# EAGLE design Neuralynx_EIB16 (EAGLE 6.3)
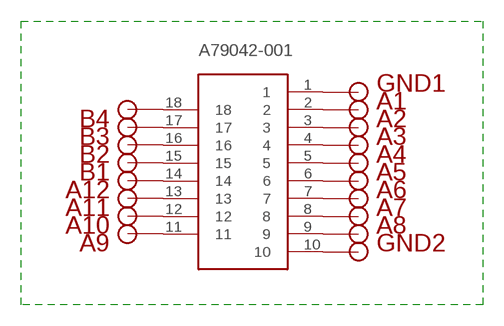
[diagram p0: schematic, sheet 1]

## Parts
A1  VIA_20MILL  [VIA_20MIL]
A2  VIA_20MILL  [VIA_20MIL]
A3  VIA_20MILL  [VIA_20MIL]
A4  VIA_20MILL  [VIA_20MIL]
A5  VIA_20MILL  [VIA_20MIL]
A6  VIA_20MILL  [VIA_20MIL]
A7  VIA_20MILL  [VIA_20MIL]
A8  VIA_20MILL  [VIA_20MIL]
A9  VIA_20MILL  [VIA_20MIL]
A10  VIA_20MILL  [VIA_20MIL]
A11  VIA_20MILL  [VIA_20MIL]
A12  VIA_20MILL  [VIA_20MIL]
A79042-001  A79043-001  [OMNETCS-18PIN-SMD]
B1  VIA_20MILL  [VIA_20MIL]
B2  VIA_20MILL  [VIA_20MIL]
B3  VIA_20MILL  [VIA_20MIL]
B4  VIA_20MILL  [VIA_20MIL]
GND1  VIA_20MILL  [VIA_20MIL]
GND2  VIA_20MILL  [VIA_20MIL]

## Nets
N$1: A79042-001.1 GND1.P$1
N$2: A79042-001.10 GND2.P$1
N$3: A8.P$1 A79042-001.9
N$4: A7.P$1 A79042-001.8
N$5: A6.P$1 A79042-001.7
N$6: A5.P$1 A79042-001.6
N$7: A4.P$1 A79042-001.5
N$8: A3.P$1 A79042-001.4
N$9: A2.P$1 A79042-001.3
N$10: A1.P$1 A79042-001.2
N$11: A9.P$1 A79042-001.11
N$12: A10.P$1 A79042-001.12
N$13: A12.P$1 A79042-001.14
N$14: A79042-001.15 B1.P$1
N$15: A79042-001.16 B2.P$1
N$16: A79042-001.17 B3.P$1
N$17: A79042-001.18 B4.P$1
N$18: A11.P$1 A79042-001.13

## Library data of the parts
A1-A12 B1-B4 GND1 GND2 = ramshur:VIA_20MILL
A79042-001 = ramshur:A79043-001: Omnetics 18 Position Dual Row Female Nano-Miniature (.025"/.64mm) Connector. Featuring 2 Guide Posts Holes and Vertical Surface Mount Tails.

## Board
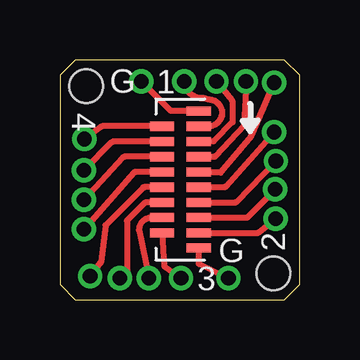
[diagram p1: board, top side]
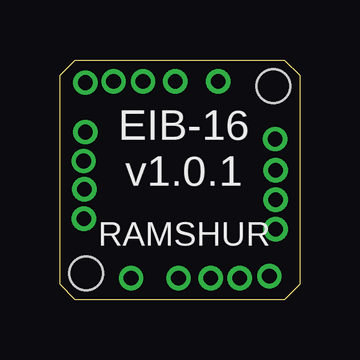
[diagram p2: board, bottom side, seen from below]

Size 10 x 10 mm. Coordinates in mm from the lower left corner, seen from the top.
Outline: 10,0.64 10,9.37 9.37,10 0.64,10 0,9.37 0,0.64 0.64,0 9.37,0 10,0.64
Copper layers (1*16): Top 0.0356mm / dielectric 1.5011mm / Bottom 0.0356mm
Design rules "LaenPCBOrder": minimum track width 6mil, minimum drill 13mil, track to track 6mil, track to pad 6mil, pad to pad 6mil, via to via 6mil, smd to smd 6mil, copper to edge 15mil, drill to drill 6mil, minimum pad ring 7mil, minimum via ring 7mil, stop-mask expansion 4mil, vias tented up to drill 0mil, thermal gap 10mil
Holes 1.4 mm at 1.1,8.9 8.9,1.1

### Footprints (pad centres in the part's own frame; a part is rotated, then mirrored left to right if it is on the bottom)
VIA_20MIL = drill 0.61 pad 1.016: P$1 0,0
OMNETCS-18PIN-SMD = smd 1.016 x 0.381: 1 1.524,5.715; 2 1.524,5.08; 3 1.524,4.445; 4 1.524,3.81; 5 1.524,3.175; 6 1.524,2.54; 7 1.524,1.905; 8 1.524,1.27; 9 1.524,0.635; 10 1.524,0; 11 0,0.635; 12 0,1.27; 13 0,1.905; 14 0,2.54; 15 0,3.175; 16 0,3.81; 17 0,4.445; 18 0,5.08

### Placement (x,y rotation side)
A1  5.19,9.1 0 top
A2  6.53,9.11 0 top
A3  7.76,9.11 0 top
A4  8.94,9.05 0 top
A5  8.94,6.99 0 top
A6  9.01,5.78 0 top
A7  8.98,4.6 0 top
A8  9,3.37 0 top
A9  5.05,0.9 0 top
A10  3.71,0.89 0 top
A11  2.5,0.9 0 top
A12  1.26,0.98 0 top
A79042-001  4.26,2.15 0 top
B1  1,2.93 0 top
B2  1,4.16 0 top
B3  1,5.4 0 top
B4  1.02,6.7 0 top
GND1  3.4,9.1 0 top
GND2  7.03,0.89 0 top

### Tracks (layer width: path | path; a pad name or v marks a point on that pad's centre or on a via)
N$1
  Top 0.254: A79042-001.1 4.68,7.87 arc-45 4.61,7.89 GND1.P$1
N$2
  Top 0.254: A79042-001.10 5.78,1.56 arc45 5.81,1.49 GND2.P$1
N$3
  Top 0.254: A79042-001.9 8.24,2.79 arc45 8.31,2.81 A8.P$1
N$4
  Top 0.254: A79042-001.8 7.78,3.42 arc45 7.85,3.45 A7.P$1
N$5
  Top 0.254: A79042-001.7 7.31,4.05 arc45 7.38,4.08 A6.P$1
N$6
  Top 0.254: A79042-001.6 6.85,4.69 arc45 6.92,4.72 A5.P$1
N$7
  Top 0.254: A79042-001.5 5.83,5.37 arc-45 5.9,5.3 6.7,5.3 7.98,6.83 A4.P$1
N$8
  Top 0.254: A79042-001.4 6.42,5.96 arc45 6.49,5.99 7.69,7.28 7.79,8.75 arc45 7.72,8.69 A3.P$1
N$9
  Top 0.254: A2.P$1 7.17,8.33 arc-45 7.2,8.26 7.2,7.4 6.42,6.62 arc-45 6.35,6.59 A79042-001.3
N$10
  Top 0.254: A79042-001.2 6.13,7.23 arc90 6.78,7.78 arc90 6.17,8.35 6,8.4 arc-90 A1.P$1
N$11
  Top 0.254: A79042-001.11 4.35,1.41 arc45 4.37,1.39 A9.P$1
N$12
  Top 0.254: A79042-001.12 3.82,3.42 arc90 3.3,2.9 A10.P$1
N$13
  Top 0.254: A79042-001.14 3.53,4.69 arc45 3.46,4.66 1.9,3.1 1.71,1.57 arc-45 1.7,1.55 A12.P$1
N$14
  Top 0.254: A79042-001.15 3.17,5.33 arc45 3.1,5.3 B1.P$1
N$15
  Top 0.254: A79042-001.16 2.7,5.96 arc45 2.63,5.93 B2.P$1
N$16
  Top 0.254: A79042-001.17 2.24,6.59 arc45 2.17,6.57 B3.P$1
N$17
  Top 0.254: A79042-001.18 1.77,7.23 arc45 1.7,7.2 B4.P$1
N$18
  Top 0.254: A79042-001.13 3.6,4.05 arc45 3.53,4.03 2.8,3.3 2.8,1.24 arc-45 2.77,1.17 A11.P$1

### Text on the board
tPlace: G | 1 | 4 | G | 2 | 3
bPlace: EIB-16 / v1.0.1 | RAMSHUR